# Altium project ANTS-MotherBoard-B1.PrjPcb (part 2 of 2)
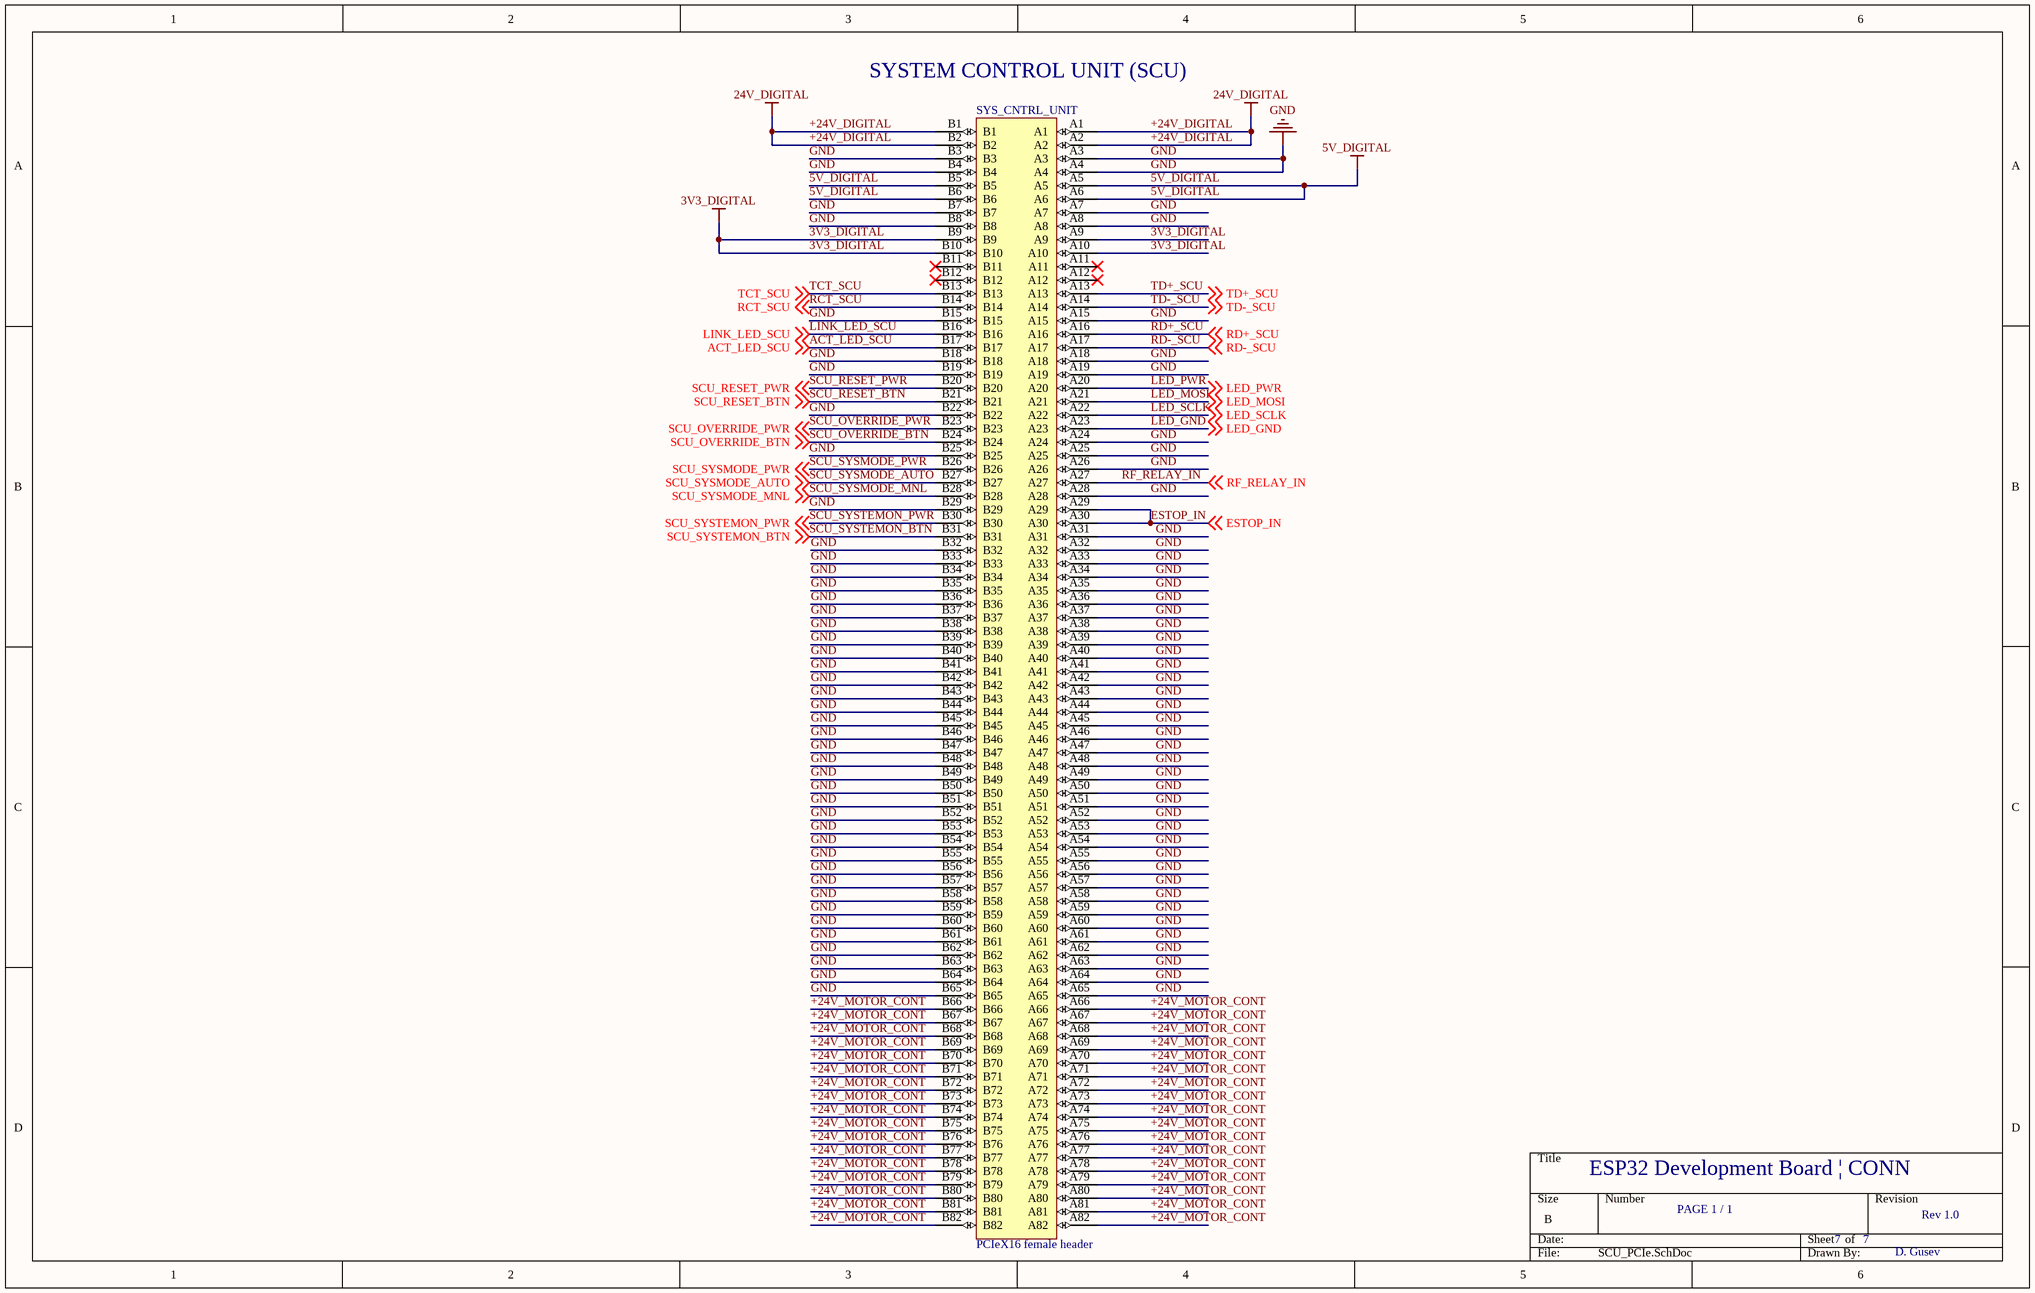
[diagram p10: SCU_PCIe.SchDoc]

## Nets that join several sheets
3V3_DIGITAL: Ethernet (8 pins), Motor1_PCIe (DRIVE_CNTRL_UNIT1.A9 DRIVE_CNTRL_UNIT1.A10 DRIVE_CNTRL_UNIT1.B9 DRIVE_CNTRL_UNIT1.B10), Motor2_PCIe (DRIVE_CNTRL_UNIT2.A9 DRIVE_CNTRL_UNIT2.A10 DRIVE_CNTRL_UNIT2.B9 DRIVE_CNTRL_UNIT2.B10), Motor3_PCIe (DRIVE_CNTRL_UNIT3.A9 DRIVE_CNTRL_UNIT3.A10 DRIVE_CNTRL_UNIT3.B9 DRIVE_CNTRL_UNIT3.B10), Motor4_PCIe (DRIVE_CNTRL_UNIT4.A9 DRIVE_CNTRL_UNIT4.A10 DRIVE_CNTRL_UNIT4.B9 DRIVE_CNTRL_UNIT4.B10), PCU_PCIe (PWR_CNTRL_UNIT.A9 PWR_CNTRL_UNIT.A10 PWR_CNTRL_UNIT.B9 PWR_CNTRL_UNIT.B10), SCU_PCIe (SYS_CNTRL_UNIT.A9 SYS_CNTRL_UNIT.A10 SYS_CNTRL_UNIT.B9 SYS_CNTRL_UNIT.B10)
5V_DIGITAL: Motor1_PCIe (DRIVE_CNTRL_UNIT1.A5 DRIVE_CNTRL_UNIT1.A6 DRIVE_CNTRL_UNIT1.B5 DRIVE_CNTRL_UNIT1.B6), Motor2_PCIe (DRIVE_CNTRL_UNIT2.A5 DRIVE_CNTRL_UNIT2.A6 DRIVE_CNTRL_UNIT2.B5 DRIVE_CNTRL_UNIT2.B6), Motor3_PCIe (DRIVE_CNTRL_UNIT3.A5 DRIVE_CNTRL_UNIT3.A6 DRIVE_CNTRL_UNIT3.B5 DRIVE_CNTRL_UNIT3.B6), Motor4_PCIe (DRIVE_CNTRL_UNIT4.A5 DRIVE_CNTRL_UNIT4.A6 DRIVE_CNTRL_UNIT4.B5 DRIVE_CNTRL_UNIT4.B6), PCU_PCIe (PWR_CNTRL_UNIT.A5 PWR_CNTRL_UNIT.A6 PWR_CNTRL_UNIT.B5 PWR_CNTRL_UNIT.B6), SCU_PCIe (SYS_CNTRL_UNIT.A5 SYS_CNTRL_UNIT.A6 SYS_CNTRL_UNIT.B5 SYS_CNTRL_UNIT.B6)
+12V_ROUTER: PCU_PCIe (PWR_CNTRL_UNIT.A34 PWR_CNTRL_UNIT.A35), Power_External_Connectors (ROUTER.1)
+12V_SPEAKER: PCU_PCIe (PWR_CNTRL_UNIT.A32 PWR_CNTRL_UNIT.A33), Power_External_Connectors (SPEAKER.1)
+19V_PC: PCU_PCIe (12 pins), Power_External_Connectors (PC_POWER.1 PC_POWER.3)
+24V_BAT_RAW: PCU_PCIe (12 pins), Power_External_Connectors (6 pins)
+24V_DIGITAL: Motor1_PCIe (DRIVE_CNTRL_UNIT1.A1 DRIVE_CNTRL_UNIT1.A2 DRIVE_CNTRL_UNIT1.B1 DRIVE_CNTRL_UNIT1.B2), Motor2_PCIe (DRIVE_CNTRL_UNIT2.A1 DRIVE_CNTRL_UNIT2.A2 DRIVE_CNTRL_UNIT2.B1 DRIVE_CNTRL_UNIT2.B2), Motor3_PCIe (DRIVE_CNTRL_UNIT3.A1 DRIVE_CNTRL_UNIT3.A2 DRIVE_CNTRL_UNIT3.B1 DRIVE_CNTRL_UNIT3.B2), Motor4_PCIe (DRIVE_CNTRL_UNIT4.A1 DRIVE_CNTRL_UNIT4.A2 DRIVE_CNTRL_UNIT4.B1 DRIVE_CNTRL_UNIT4.B2), Motor_External_Connectors (C7.1 U1.1), PCU_PCIe (PWR_CNTRL_UNIT.A1 PWR_CNTRL_UNIT.A2 PWR_CNTRL_UNIT.B1 PWR_CNTRL_UNIT.B2), SCU_PCIe (SYS_CNTRL_UNIT.A1 SYS_CNTRL_UNIT.A2 SYS_CNTRL_UNIT.B1 SYS_CNTRL_UNIT.B2)
+24V_MOTOR: Motor1_PCIe (34 pins), Motor2_PCIe (34 pins), Motor3_PCIe (34 pins), Motor4_PCIe (34 pins), Motor_External_Connectors (GIGAVAC.1 GIGAVAC.2 GIGAVAC.7 GIGAVAC.8)
+24V_MOTOR_CONT: Motor_External_Connectors (GIGAVAC.5 GIGAVAC.6 GIGAVAC.11 GIGAVAC.12), PCU_PCIe (34 pins), SCU_PCIe (34 pins)
BAT_GND: PCU_PCIe (11 pins), Power_External_Connectors (6 pins)
CHARGER_VCC: PCU_PCIe (5 pins), Power_External_Connectors (CHARGER_CONN.1 CHARGER_CONN.3)
CHRG_GND: PCU_PCIe (5 pins), Power_External_Connectors (CHARGER_CONN.2 CHARGER_CONN.4)
EXTRA_GND: PCU_PCIe (PWR_CNTRL_UNIT.B33 PWR_CNTRL_UNIT.B34 PWR_CNTRL_UNIT.B35), Power_External_Connectors (ROUTER.2 ROUTER.3 SPEAKER.2 SPEAKER.3)
GND: Ethernet (8 pins), Motor1_PCIe (47 pins), Motor2_PCIe (45 pins), Motor3_PCIe (45 pins), Motor4_PCIe (45 pins), Motor_External_Connectors (16 pins), PCU_PCIe (33 pins), Power_External_Connectors (RF-RELAY.2 RF-RELAY.5), SCU_External_Connectors (SYSMODE_BTN.4), SCU_PCIe (90 pins)
PC_GND: PCU_PCIe (13 pins), Power_External_Connectors (PC_POWER.2 PC_POWER.4)
12V_RF_RELAY: PCU_PCIe (PWR_CNTRL_UNIT.A26), Power_External_Connectors (RF-RELAY.1)
12V_SIG_RF: PCU_PCIe (PWR_CNTRL_UNIT.B26), Power_External_Connectors (RF-RELAY.3)
ACT_LED_DCU1: Ethernet (R6.2), Motor1_PCIe (DRIVE_CNTRL_UNIT1.B17)
ACT_LED_DCU2: Ethernet (R8.2), Motor2_PCIe (DRIVE_CNTRL_UNIT2.B17)
ACT_LED_PCU: Ethernet (R2.2), PCU_PCIe (PWR_CNTRL_UNIT.B17)
ACT_LED_SCU: Ethernet (R4.2), SCU_PCIe (SYS_CNTRL_UNIT.B17)
ENC1-A: Motor1_PCIe (DRIVE_CNTRL_UNIT1.A25), Motor_External_Connectors (MOTOR1_OUT.6)
ENC1-B: Motor1_PCIe (DRIVE_CNTRL_UNIT1.A26), Motor_External_Connectors (MOTOR1_OUT.7)
ENC1-PWR: Motor1_PCIe (DRIVE_CNTRL_UNIT1.A24), Motor_External_Connectors (MOTOR1_OUT.2)
ENC2-A: Motor1_PCIe (DRIVE_CNTRL_UNIT1.B21), Motor_External_Connectors (MOTOR2_OUT.6)
ENC2-B: Motor1_PCIe (DRIVE_CNTRL_UNIT1.B22), Motor_External_Connectors (MOTOR2_OUT.7)
ENC2-PWR: Motor1_PCIe (DRIVE_CNTRL_UNIT1.B20), Motor_External_Connectors (MOTOR2_OUT.2)
ENC3-A: Motor1_PCIe (DRIVE_CNTRL_UNIT1.B26), Motor_External_Connectors (MOTOR3_OUT.6)
ENC3-B: Motor1_PCIe (DRIVE_CNTRL_UNIT1.B27), Motor_External_Connectors (MOTOR3_OUT.7)
ENC3-PWR: Motor1_PCIe (DRIVE_CNTRL_UNIT1.B25), Motor_External_Connectors (MOTOR3_OUT.2)
ENC4-A: Motor1_PCIe (DRIVE_CNTRL_UNIT1.A30), Motor_External_Connectors (MOTOR4_OUT.6)
ENC4-B: Motor1_PCIe (DRIVE_CNTRL_UNIT1.A31), Motor_External_Connectors (MOTOR4_OUT.7)
ENC4-PWR: Motor1_PCIe (DRIVE_CNTRL_UNIT1.A29), Motor_External_Connectors (MOTOR4_OUT.2)
ESTOP_12V: PCU_PCIe (PWR_CNTRL_UNIT.A29 PWR_CNTRL_UNIT.A30), Power_External_Connectors (ESTOP.2)
ESTOP_IN: PCU_PCIe (PWR_CNTRL_UNIT.B29 PWR_CNTRL_UNIT.B30), Power_External_Connectors (ESTOP.1), SCU_PCIe (SYS_CNTRL_UNIT.A29 SYS_CNTRL_UNIT.A30)
GIGAVAC-NC: Motor1_PCIe (DRIVE_CNTRL_UNIT1.A34), Motor_External_Connectors (GIGAVAC.9)
GIGAVAC-NO: Motor1_PCIe (DRIVE_CNTRL_UNIT1.B34), Motor_External_Connectors (GIGAVAC.10)
LED_GND: SCU_External_Connectors (LED_CONN.4), SCU_PCIe (SYS_CNTRL_UNIT.A23)
LED_MOSI: SCU_External_Connectors (LED_CONN.2), SCU_PCIe (SYS_CNTRL_UNIT.A21)
LED_PWR: SCU_External_Connectors (LED_CONN.1), SCU_PCIe (SYS_CNTRL_UNIT.A20)
LED_SCLK: SCU_External_Connectors (LED_CONN.3), SCU_PCIe (SYS_CNTRL_UNIT.A22)
LINK_LED_DCU1: Ethernet (R5.2), Motor1_PCIe (DRIVE_CNTRL_UNIT1.B16)
LINK_LED_DCU2: Ethernet (R7.2), Motor2_PCIe (DRIVE_CNTRL_UNIT2.B16)
LINK_LED_PCU: Ethernet (R1.2), PCU_PCIe (PWR_CNTRL_UNIT.B16)
LINK_LED_SCU: Ethernet (R3.2), SCU_PCIe (SYS_CNTRL_UNIT.B16)
MOTOR1_CHA: Motor1_PCIe (5 pins), Motor2_PCIe (5 pins), Motor3_PCIe (5 pins), Motor4_PCIe (5 pins), Motor_External_Connectors (MOTOR1_OUT.1 MOTOR1_OUT.5)
MOTOR1_CHB: Motor1_PCIe (5 pins), Motor2_PCIe (5 pins), Motor3_PCIe (5 pins), Motor4_PCIe (5 pins), Motor_External_Connectors (MOTOR1_OUT.4 MOTOR1_OUT.8)
MOTOR2_CHA: Motor1_PCIe (5 pins), Motor2_PCIe (5 pins), Motor3_PCIe (5 pins), Motor4_PCIe (5 pins), Motor_External_Connectors (MOTOR2_OUT.4 MOTOR2_OUT.8)
MOTOR2_CHB: Motor1_PCIe (5 pins), Motor2_PCIe (5 pins), Motor3_PCIe (5 pins), Motor4_PCIe (5 pins), Motor_External_Connectors (MOTOR2_OUT.1 MOTOR2_OUT.5)
MOTOR3_CHA: Motor1_PCIe (5 pins), Motor2_PCIe (5 pins), Motor3_PCIe (5 pins), Motor4_PCIe (5 pins), Motor_External_Connectors (MOTOR3_OUT.4 MOTOR3_OUT.8)
MOTOR3_CHB: Motor1_PCIe (5 pins), Motor2_PCIe (5 pins), Motor3_PCIe (5 pins), Motor4_PCIe (5 pins), Motor_External_Connectors (MOTOR3_OUT.1 MOTOR3_OUT.5)
MOTOR4_CHA: Motor1_PCIe (5 pins), Motor2_PCIe (5 pins), Motor3_PCIe (5 pins), Motor4_PCIe (5 pins), Motor_External_Connectors (MOTOR4_OUT.1 MOTOR4_OUT.5)
MOTOR4_CHB: Motor1_PCIe (5 pins), Motor2_PCIe (5 pins), Motor3_PCIe (5 pins), Motor4_PCIe (5 pins), Motor_External_Connectors (MOTOR4_OUT.4 MOTOR4_OUT.8)
RCT_DCU1: Ethernet (ETH_DCU1.6), Motor1_PCIe (DRIVE_CNTRL_UNIT1.B14)
RCT_DCU2: Ethernet (ETH_DCU2.6), Motor2_PCIe (DRIVE_CNTRL_UNIT2.B14)
RCT_PCU: Ethernet (ETH_PCU.6), PCU_PCIe (PWR_CNTRL_UNIT.B14)
RCT_SCU: Ethernet (ETH_SCU.6), SCU_PCIe (SYS_CNTRL_UNIT.B14)
RD+_DCU1: Ethernet (ETH_DCU1.5), Motor1_PCIe (DRIVE_CNTRL_UNIT1.A16)
RD+_DCU2: Ethernet (ETH_DCU2.5), Motor2_PCIe (DRIVE_CNTRL_UNIT2.A16)
RD+_PCU: Ethernet (ETH_PCU.5), PCU_PCIe (PWR_CNTRL_UNIT.A16)
RD+_SCU: Ethernet (ETH_SCU.5), SCU_PCIe (SYS_CNTRL_UNIT.A16)
RD-_DCU1: Ethernet (ETH_DCU1.7), Motor1_PCIe (DRIVE_CNTRL_UNIT1.A17)
RD-_DCU2: Ethernet (ETH_DCU2.7), Motor2_PCIe (DRIVE_CNTRL_UNIT2.A17)
RD-_PCU: Ethernet (ETH_PCU.7), PCU_PCIe (PWR_CNTRL_UNIT.A17)
RD-_SCU: Ethernet (ETH_SCU.7), SCU_PCIe (SYS_CNTRL_UNIT.A17)
RF_RELAY_IN: PCU_PCIe (PWR_CNTRL_UNIT.B27), Power_External_Connectors (RF-RELAY.4), SCU_PCIe (SYS_CNTRL_UNIT.A27)
SCU_OVERRIDE_BTN: SCU_External_Connectors (OVERRIDE_BTN.1), SCU_PCIe (SYS_CNTRL_UNIT.B24)
SCU_OVERRIDE_PWR: SCU_External_Connectors (OVERRIDE_BTN.2), SCU_PCIe (SYS_CNTRL_UNIT.B23)
SCU_RESET_BTN: SCU_External_Connectors (RESET_BTN.1), SCU_PCIe (SYS_CNTRL_UNIT.B21)
SCU_RESET_PWR: SCU_External_Connectors (RESET_BTN.2), SCU_PCIe (SYS_CNTRL_UNIT.B20)
SCU_SYSMODE_AUTO: SCU_External_Connectors (SYSMODE_BTN.2), SCU_PCIe (SYS_CNTRL_UNIT.B27)
SCU_SYSMODE_MNL: SCU_External_Connectors (SYSMODE_BTN.3), SCU_PCIe (SYS_CNTRL_UNIT.B28)
SCU_SYSMODE_PWR: SCU_External_Connectors (SYSMODE_BTN.1), SCU_PCIe (SYS_CNTRL_UNIT.B26)
SCU_SYSTEMON_BTN: SCU_External_Connectors (SYSTEMON_BTN.1), SCU_PCIe (SYS_CNTRL_UNIT.B31)
SCU_SYSTEMON_PWR: SCU_External_Connectors (SYSTEMON_BTN.2), SCU_PCIe (SYS_CNTRL_UNIT.B30)
TCT_DCU1: Ethernet (ETH_DCU1.2), Motor1_PCIe (DRIVE_CNTRL_UNIT1.B13)
TCT_DCU2: Ethernet (ETH_DCU2.2), Motor2_PCIe (DRIVE_CNTRL_UNIT2.B13)
TCT_PCU: Ethernet (ETH_PCU.2), PCU_PCIe (PWR_CNTRL_UNIT.B13)
TCT_SCU: Ethernet (ETH_SCU.2), SCU_PCIe (SYS_CNTRL_UNIT.B13)
TD+_DCU1: Ethernet (ETH_DCU1.1), Motor1_PCIe (DRIVE_CNTRL_UNIT1.A13)
TD+_DCU2: Ethernet (ETH_DCU2.1), Motor2_PCIe (DRIVE_CNTRL_UNIT2.A13)
TD+_PCU: Ethernet (ETH_PCU.1), PCU_PCIe (PWR_CNTRL_UNIT.A13)
TD+_SCU: Ethernet (ETH_SCU.1), SCU_PCIe (SYS_CNTRL_UNIT.A13)
TD-_DCU1: Ethernet (ETH_DCU1.3), Motor1_PCIe (DRIVE_CNTRL_UNIT1.A14)
TD-_DCU2: Ethernet (ETH_DCU2.3), Motor2_PCIe (DRIVE_CNTRL_UNIT2.A14)
TD-_PCU: Ethernet (ETH_PCU.3), PCU_PCIe (PWR_CNTRL_UNIT.A14)
TD-_SCU: Ethernet (ETH_SCU.3), SCU_PCIe (SYS_CNTRL_UNIT.A14)